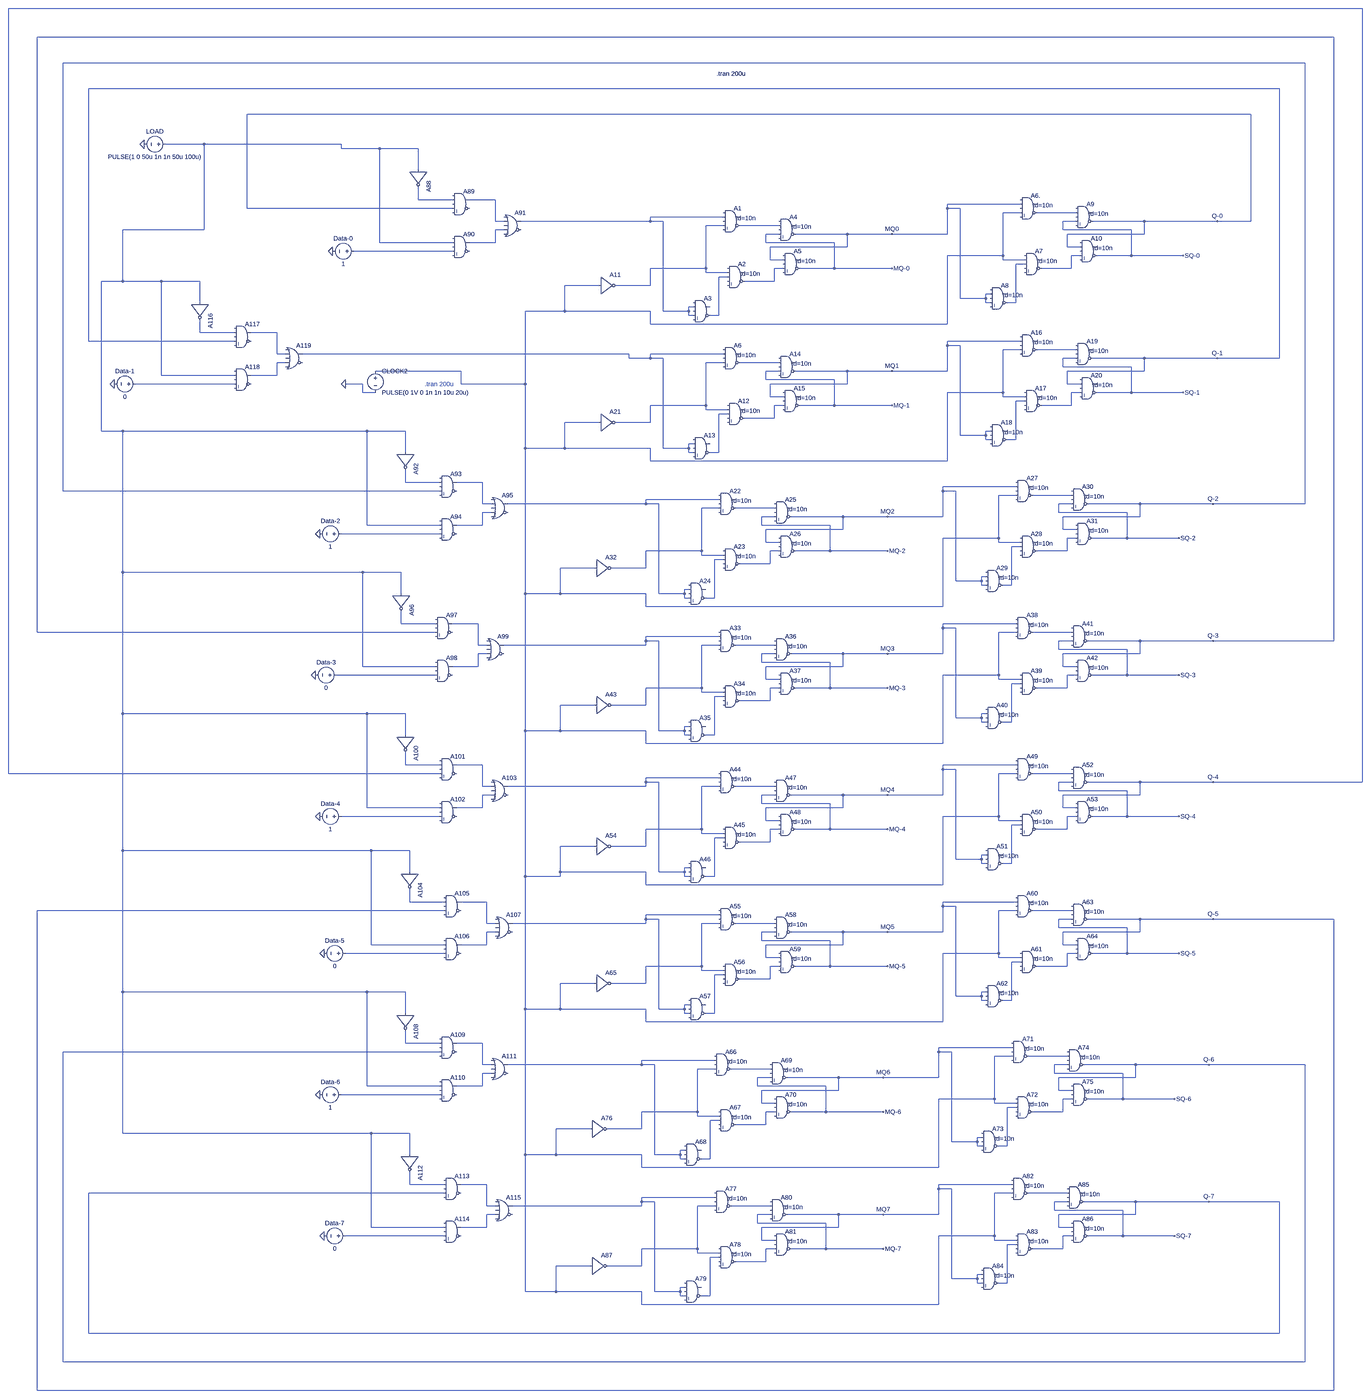
[diagram p0: schematic 8-Bit-Register.asc, whole sheet]
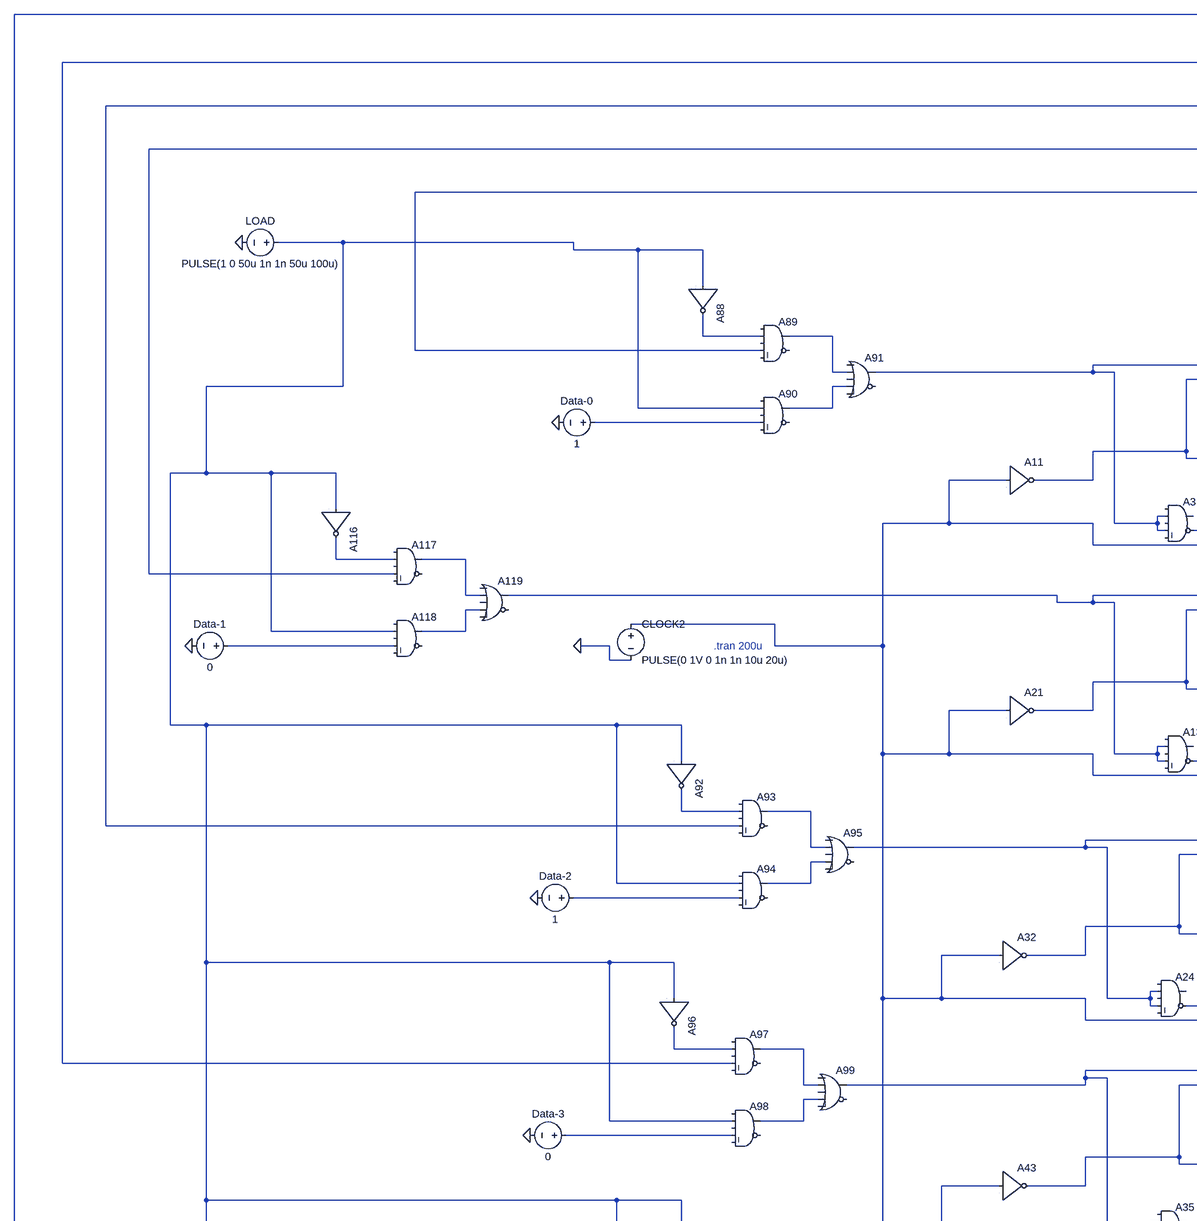
[diagram p1: schematic 8-Bit-Register.asc, part, row 1 of 2, column 1 of 2]
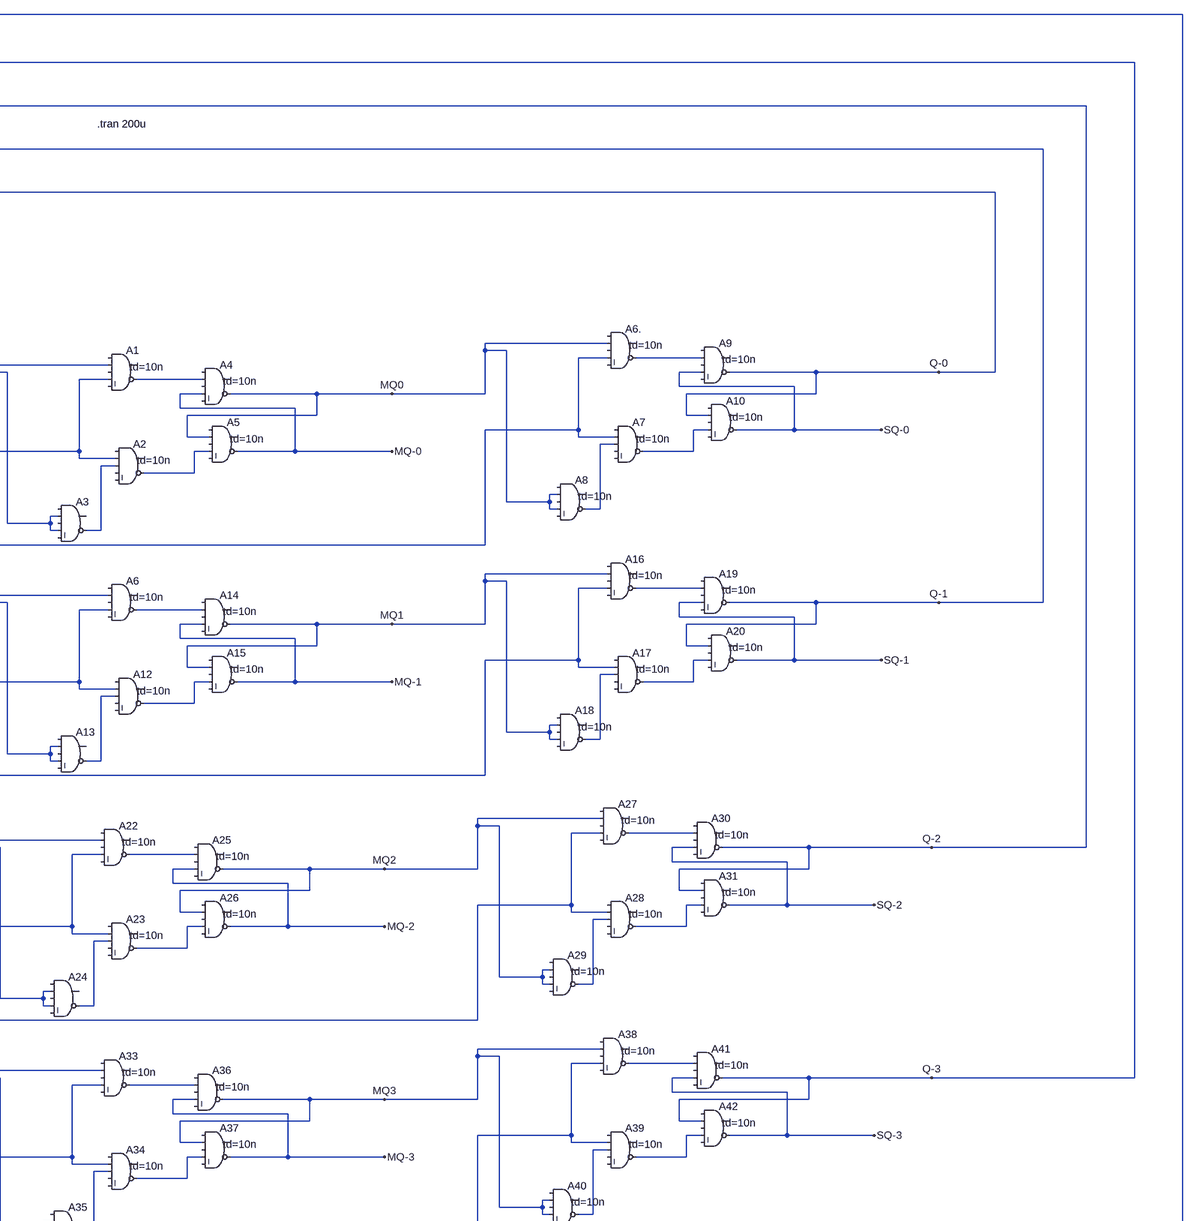
[diagram p2: schematic 8-Bit-Register.asc, part, row 1 of 2, column 2 of 2]
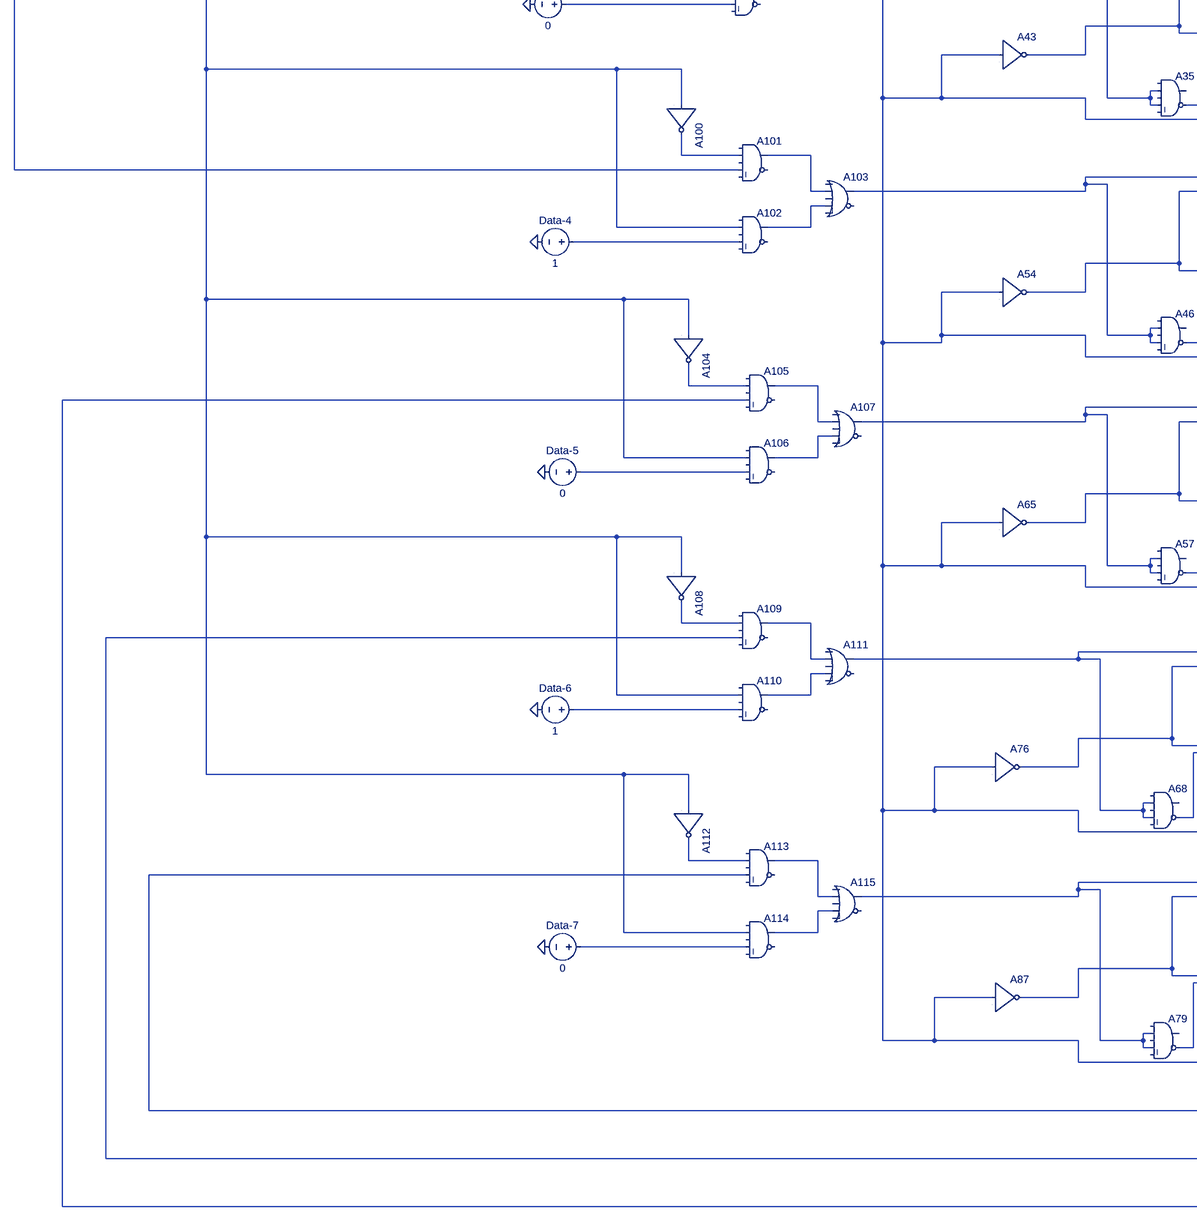
[diagram p3: schematic 8-Bit-Register.asc, part, row 2 of 2, column 1 of 2]
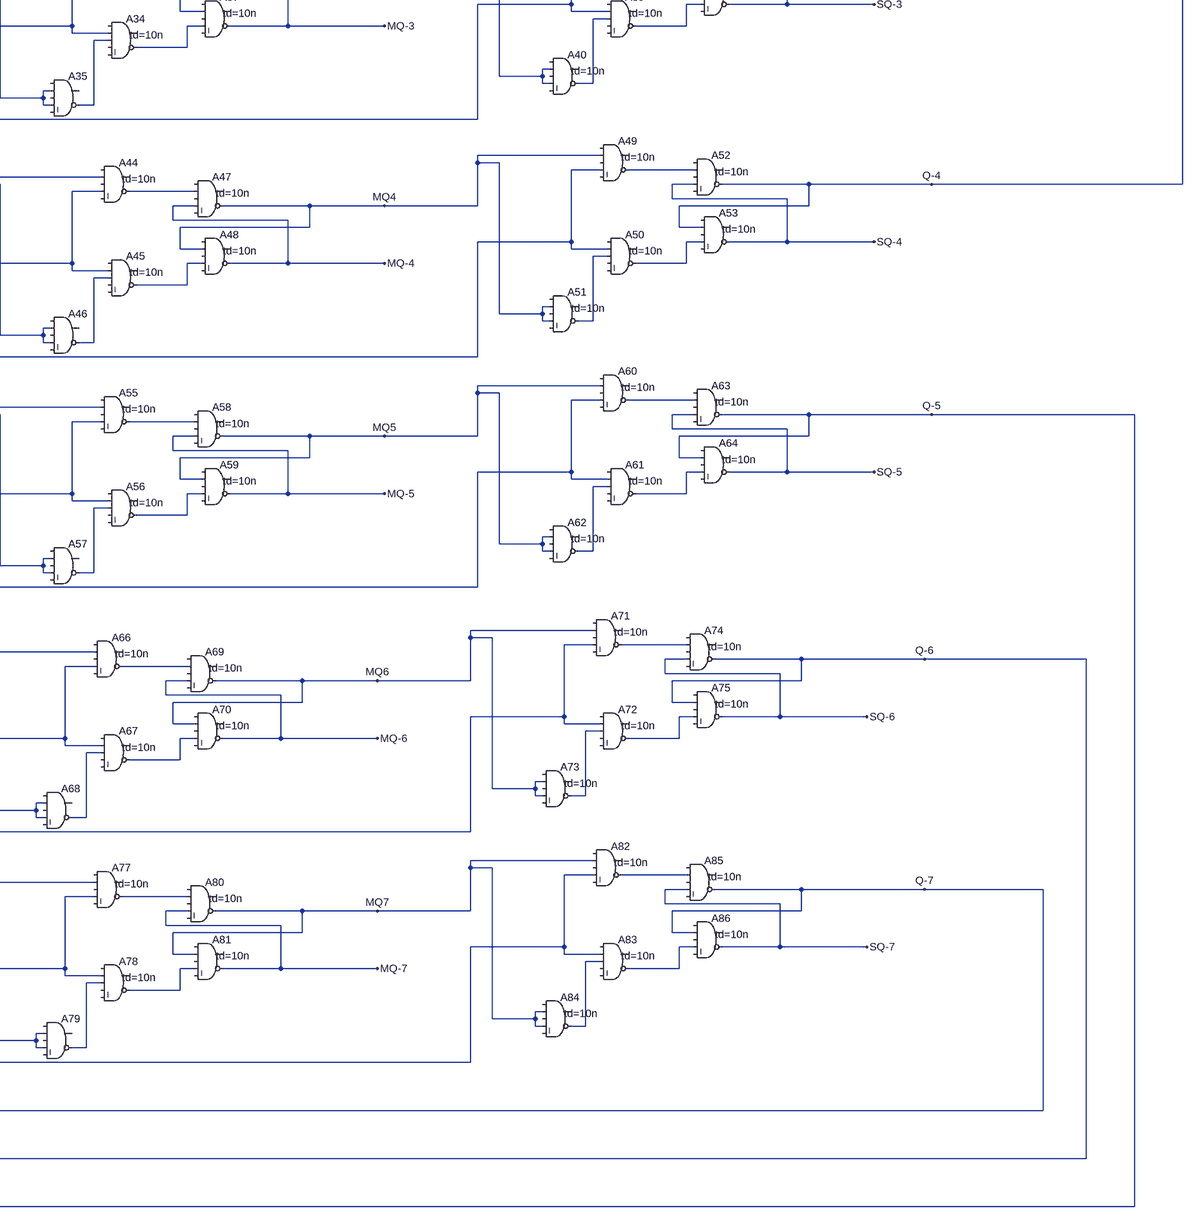
[diagram p4: schematic 8-Bit-Register.asc, part, row 2 of 2, column 2 of 2]
8-Bit-Register.asc, the LTspice schematic file:
Version 4.1
SHEET 1 3268 4692
WIRE 3152 -768 -2224 -768
WIRE 3040 -656 -2112 -656
WIRE 2928 -560 -2016 -560
WIRE 2832 -464 -1920 -464
WIRE 2720 -368 -1328 -368
WIRE -1488 -256 -1632 -256
WIRE -976 -256 -1488 -256
WIRE -976 -240 -976 -256
WIRE -832 -240 -976 -240
WIRE -688 -240 -832 -240
WIRE -688 -160 -688 -240
WIRE -688 -48 -688 -96
WIRE -560 -48 -688 -48
WIRE -400 -48 -496 -48
WIRE 1696 -32 1424 -32
WIRE -1328 -16 -1328 -368
WIRE -560 -16 -1328 -16
WIRE 1424 -16 1424 -32
WIRE 1472 -16 1424 -16
WIRE 1696 0 1632 0
WIRE 1904 0 1760 0
WIRE 496 16 224 16
WIRE -400 32 -400 -48
WIRE -368 32 -400 32
WIRE 224 32 224 16
WIRE 224 32 -304 32
WIRE 272 32 224 32
WIRE 1904 32 1856 32
WIRE 2160 32 1968 32
WIRE 2480 32 2160 32
WIRE 2720 32 2720 -368
WIRE 2720 32 2480 32
WIRE 496 48 432 48
WIRE 704 48 560 48
WIRE -1488 64 -1488 -256
WIRE -1488 64 -1792 64
WIRE -368 64 -400 64
WIRE 1856 64 1856 32
WIRE 2112 64 1856 64
WIRE 704 80 656 80
WIRE 960 80 768 80
WIRE 1152 80 960 80
WIRE 1424 80 1424 -16
WIRE 1424 80 1152 80
WIRE 2160 80 2160 32
WIRE 2160 80 1872 80
WIRE -832 112 -832 -240
WIRE -560 112 -832 112
WIRE -400 112 -400 64
WIRE -400 112 -496 112
WIRE 656 112 656 80
WIRE 912 112 656 112
WIRE 960 128 960 80
WIRE 960 128 672 128
WIRE 1872 128 1872 80
WIRE 1920 128 1872 128
WIRE -560 144 -928 144
WIRE 1632 160 1632 0
WIRE 1632 160 1424 160
WIRE 1920 160 1888 160
WIRE 2112 160 2112 64
WIRE 2112 160 1984 160
WIRE 2352 160 2112 160
WIRE 672 176 672 128
WIRE 720 176 672 176
WIRE 1632 176 1632 160
WIRE 1712 176 1632 176
WIRE 1712 192 1680 192
WIRE 432 208 432 48
WIRE 432 208 224 208
WIRE 720 208 688 208
WIRE 912 208 912 112
WIRE 912 208 784 208
WIRE 1152 208 912 208
WIRE 1888 208 1888 160
WIRE 1888 208 1776 208
WIRE 432 224 432 208
WIRE 512 224 432 224
WIRE 512 240 480 240
WIRE -1792 256 -1792 64
WIRE -1792 256 -1872 256
WIRE -1648 256 -1792 256
WIRE -1504 256 -1648 256
WIRE 688 256 688 208
WIRE 688 256 576 256
WIRE 32 272 -96 272
WIRE 224 272 224 208
WIRE 224 272 96 272
WIRE 1584 304 1568 304
WIRE 1472 320 1472 -16
WIRE 1568 320 1568 304
WIRE 1568 320 1472 320
WIRE -1504 336 -1504 256
WIRE 1568 336 1568 320
WIRE 1584 336 1568 336
WIRE 1680 336 1680 192
WIRE 1680 336 1648 336
WIRE 384 352 368 352
WIRE -96 368 -96 272
WIRE -96 368 -288 368
WIRE 224 368 -96 368
WIRE 272 368 272 32
WIRE 368 368 368 352
WIRE 368 368 272 368
WIRE 368 384 368 368
WIRE 384 384 368 384
WIRE 480 384 480 240
WIRE 480 384 448 384
WIRE 224 416 224 368
WIRE 1424 416 1424 160
WIRE 1424 416 224 416
WIRE -1504 448 -1504 400
WIRE -1376 448 -1504 448
WIRE -1216 448 -1312 448
WIRE -1920 480 -1920 -464
WIRE -1376 480 -1920 480
WIRE 1696 480 1424 480
WIRE 1424 496 1424 480
WIRE 1472 496 1424 496
WIRE 1696 512 1632 512
WIRE 1904 512 1760 512
WIRE -1216 528 -1216 448
WIRE -1184 528 -1216 528
WIRE 144 528 -1120 528
WIRE 496 528 224 528
WIRE 144 544 144 528
WIRE 224 544 224 528
WIRE 224 544 144 544
WIRE 272 544 224 544
WIRE 1904 544 1856 544
WIRE 2160 544 1968 544
WIRE 2480 544 2160 544
WIRE 2832 544 2832 -464
WIRE 2832 544 2480 544
WIRE -1184 560 -1216 560
WIRE 496 560 432 560
WIRE 704 560 560 560
WIRE 1856 576 1856 544
WIRE 2112 576 1856 576
WIRE -528 592 -848 592
WIRE 704 592 656 592
WIRE 960 592 768 592
WIRE 1152 592 960 592
WIRE 1424 592 1424 496
WIRE 1424 592 1152 592
WIRE 2160 592 2160 544
WIRE 2160 592 1872 592
WIRE -1648 608 -1648 256
WIRE -1376 608 -1648 608
WIRE -1216 608 -1216 560
WIRE -1216 608 -1312 608
WIRE 656 624 656 592
WIRE 912 624 656 624
WIRE -1376 640 -1744 640
WIRE -896 640 -960 640
WIRE -528 640 -528 592
WIRE -288 640 -288 368
WIRE -288 640 -528 640
WIRE 960 640 960 592
WIRE 960 640 672 640
WIRE 1872 640 1872 592
WIRE 1920 640 1872 640
WIRE -896 672 -896 640
WIRE -848 672 -896 672
WIRE 1632 672 1632 512
WIRE 1632 672 1424 672
WIRE 1920 672 1888 672
WIRE 2112 672 2112 576
WIRE 2112 672 1984 672
WIRE 2352 672 2112 672
WIRE 672 688 672 640
WIRE 720 688 672 688
WIRE 1632 688 1632 672
WIRE 1712 688 1632 688
WIRE 1712 704 1680 704
WIRE 432 720 432 560
WIRE 432 720 224 720
WIRE 720 720 688 720
WIRE 912 720 912 624
WIRE 912 720 784 720
WIRE 1152 720 912 720
WIRE 1888 720 1888 672
WIRE 1888 720 1776 720
WIRE 432 736 432 720
WIRE 512 736 432 736
WIRE 512 752 480 752
WIRE 688 768 688 720
WIRE 688 768 576 768
WIRE 32 784 -96 784
WIRE 224 784 224 720
WIRE 224 784 96 784
WIRE -1872 816 -1872 256
WIRE -1792 816 -1872 816
WIRE -880 816 -1792 816
WIRE -736 816 -880 816
WIRE 1584 816 1568 816
WIRE 1472 832 1472 496
WIRE 1568 832 1568 816
WIRE 1568 832 1472 832
WIRE 1568 848 1568 832
WIRE 1584 848 1568 848
WIRE 1680 848 1680 704
WIRE 1680 848 1648 848
WIRE 384 864 368 864
WIRE -288 880 -288 640
WIRE -96 880 -96 784
WIRE -96 880 -288 880
WIRE 224 880 -96 880
WIRE 272 880 272 544
WIRE 368 880 368 864
WIRE 368 880 272 880
WIRE -736 896 -736 816
WIRE 368 896 368 880
WIRE 384 896 368 896
WIRE 480 896 480 752
WIRE 480 896 448 896
WIRE 224 928 224 880
WIRE 1424 928 1424 672
WIRE 1424 928 224 928
WIRE -736 1008 -736 960
WIRE -608 1008 -736 1008
WIRE -448 1008 -544 1008
WIRE 1680 1024 1408 1024
WIRE -2016 1040 -2016 -560
WIRE -608 1040 -2016 1040
WIRE 1408 1040 1408 1024
WIRE 1456 1040 1408 1040
WIRE 1680 1056 1616 1056
WIRE 1888 1056 1744 1056
WIRE 480 1072 208 1072
WIRE -448 1088 -448 1008
WIRE -416 1088 -448 1088
WIRE 208 1088 208 1072
WIRE 208 1088 -352 1088
WIRE 256 1088 208 1088
WIRE 1888 1088 1840 1088
WIRE 2144 1088 1952 1088
WIRE 2464 1088 2144 1088
WIRE 2928 1088 2928 -560
WIRE 2928 1088 2464 1088
WIRE 480 1104 416 1104
WIRE 688 1104 544 1104
WIRE -416 1120 -448 1120
WIRE 1840 1120 1840 1088
WIRE 2096 1120 1840 1120
WIRE 688 1136 640 1136
WIRE 944 1136 752 1136
WIRE 1136 1136 944 1136
WIRE 1408 1136 1408 1040
WIRE 1408 1136 1136 1136
WIRE 2144 1136 2144 1088
WIRE 2144 1136 1856 1136
WIRE -880 1168 -880 816
WIRE -608 1168 -880 1168
WIRE -448 1168 -448 1120
WIRE -448 1168 -544 1168
WIRE 640 1168 640 1136
WIRE 896 1168 640 1168
WIRE 944 1184 944 1136
WIRE 944 1184 656 1184
WIRE 1856 1184 1856 1136
WIRE 1904 1184 1856 1184
WIRE -608 1200 -976 1200
WIRE 1616 1216 1616 1056
WIRE 1616 1216 1408 1216
WIRE 1904 1216 1872 1216
WIRE 2096 1216 2096 1120
WIRE 2096 1216 1968 1216
WIRE 2336 1216 2096 1216
WIRE 656 1232 656 1184
WIRE 704 1232 656 1232
WIRE 1616 1232 1616 1216
WIRE 1696 1232 1616 1232
WIRE 1696 1248 1664 1248
WIRE 416 1264 416 1104
WIRE 416 1264 208 1264
WIRE 704 1264 672 1264
WIRE 896 1264 896 1168
WIRE 896 1264 768 1264
WIRE 1136 1264 896 1264
WIRE 1872 1264 1872 1216
WIRE 1872 1264 1760 1264
WIRE 416 1280 416 1264
WIRE 496 1280 416 1280
WIRE 496 1296 464 1296
WIRE 672 1312 672 1264
WIRE 672 1312 560 1312
WIRE 16 1328 -112 1328
WIRE 208 1328 208 1264
WIRE 208 1328 80 1328
WIRE -1792 1344 -1792 816
WIRE -896 1344 -1792 1344
WIRE -752 1344 -896 1344
WIRE 1568 1360 1552 1360
WIRE 1456 1376 1456 1040
WIRE 1552 1376 1552 1360
WIRE 1552 1376 1456 1376
WIRE 1552 1392 1552 1376
WIRE 1568 1392 1552 1392
WIRE 1664 1392 1664 1248
WIRE 1664 1392 1632 1392
WIRE 368 1408 352 1408
WIRE -752 1424 -752 1344
WIRE -288 1424 -288 880
WIRE -112 1424 -112 1328
WIRE -112 1424 -288 1424
WIRE 208 1424 -112 1424
WIRE 256 1424 256 1088
WIRE 352 1424 352 1408
WIRE 352 1424 256 1424
WIRE 352 1440 352 1424
WIRE 368 1440 352 1440
WIRE 464 1440 464 1296
WIRE 464 1440 432 1440
WIRE 208 1472 208 1424
WIRE 1408 1472 1408 1216
WIRE 1408 1472 208 1472
WIRE -752 1536 -752 1488
WIRE -624 1536 -752 1536
WIRE -464 1536 -560 1536
WIRE 1680 1536 1408 1536
WIRE 1408 1552 1408 1536
WIRE 1456 1552 1408 1552
WIRE -2112 1568 -2112 -656
WIRE -624 1568 -2112 1568
WIRE 1680 1568 1616 1568
WIRE 1888 1568 1744 1568
WIRE 480 1584 208 1584
WIRE 208 1600 208 1584
WIRE 256 1600 208 1600
WIRE 1888 1600 1840 1600
WIRE 2144 1600 1952 1600
WIRE 2464 1600 2144 1600
WIRE 3040 1600 3040 -656
WIRE 3040 1600 2464 1600
WIRE -464 1616 -464 1536
WIRE -432 1616 -464 1616
WIRE 208 1616 208 1600
WIRE 208 1616 -368 1616
WIRE 480 1616 416 1616
WIRE 688 1616 544 1616
WIRE 1840 1632 1840 1600
WIRE 2096 1632 1840 1632
WIRE -432 1648 -464 1648
WIRE 688 1648 640 1648
WIRE 944 1648 752 1648
WIRE 1136 1648 944 1648
WIRE 1408 1648 1408 1552
WIRE 1408 1648 1136 1648
WIRE 2144 1648 2144 1600
WIRE 2144 1648 1856 1648
WIRE 640 1680 640 1648
WIRE 896 1680 640 1680
WIRE -896 1696 -896 1344
WIRE -624 1696 -896 1696
WIRE -464 1696 -464 1648
WIRE -464 1696 -560 1696
WIRE 944 1696 944 1648
WIRE 944 1696 656 1696
WIRE 1856 1696 1856 1648
WIRE 1904 1696 1856 1696
WIRE -624 1728 -992 1728
WIRE 1616 1728 1616 1568
WIRE 1616 1728 1408 1728
WIRE 1904 1728 1872 1728
WIRE 2096 1728 2096 1632
WIRE 2096 1728 1968 1728
WIRE 2336 1728 2096 1728
WIRE 656 1744 656 1696
WIRE 704 1744 656 1744
WIRE 1616 1744 1616 1728
WIRE 1696 1744 1616 1744
WIRE 1696 1760 1664 1760
WIRE 416 1776 416 1616
WIRE 416 1776 208 1776
WIRE 704 1776 672 1776
WIRE 896 1776 896 1680
WIRE 896 1776 768 1776
WIRE 1136 1776 896 1776
WIRE 1872 1776 1872 1728
WIRE 1872 1776 1760 1776
WIRE 416 1792 416 1776
WIRE 496 1792 416 1792
WIRE 496 1808 464 1808
WIRE 672 1824 672 1776
WIRE 672 1824 560 1824
WIRE 16 1840 -112 1840
WIRE 208 1840 208 1776
WIRE 208 1840 80 1840
WIRE -1792 1872 -1792 1344
WIRE -880 1872 -1792 1872
WIRE -736 1872 -880 1872
WIRE 1568 1872 1552 1872
WIRE 1456 1888 1456 1552
WIRE 1552 1888 1552 1872
WIRE 1552 1888 1456 1888
WIRE 1552 1904 1552 1888
WIRE 1568 1904 1552 1904
WIRE 1664 1904 1664 1760
WIRE 1664 1904 1632 1904
WIRE 368 1920 352 1920
WIRE -288 1936 -288 1424
WIRE -112 1936 -112 1840
WIRE -112 1936 -288 1936
WIRE 208 1936 -112 1936
WIRE 256 1936 256 1600
WIRE 352 1936 352 1920
WIRE 352 1936 256 1936
WIRE -736 1952 -736 1872
WIRE 352 1952 352 1936
WIRE 368 1952 352 1952
WIRE 464 1952 464 1808
WIRE 464 1952 432 1952
WIRE 208 1984 208 1936
WIRE 1408 1984 1408 1728
WIRE 1408 1984 208 1984
WIRE -736 2064 -736 2016
WIRE -608 2064 -736 2064
WIRE -448 2064 -544 2064
WIRE 1680 2064 1408 2064
WIRE 1408 2080 1408 2064
WIRE 1456 2080 1408 2080
WIRE -2224 2096 -2224 -768
WIRE -608 2096 -2224 2096
WIRE 1680 2096 1616 2096
WIRE 1888 2096 1744 2096
WIRE 480 2112 208 2112
WIRE 208 2128 208 2112
WIRE 256 2128 208 2128
WIRE 1888 2128 1840 2128
WIRE 2144 2128 1952 2128
WIRE 2464 2128 2144 2128
WIRE 3152 2128 3152 -768
WIRE 3152 2128 2464 2128
WIRE -448 2144 -448 2064
WIRE -416 2144 -448 2144
WIRE 208 2144 208 2128
WIRE 208 2144 -352 2144
WIRE 480 2144 416 2144
WIRE 688 2144 544 2144
WIRE 1840 2160 1840 2128
WIRE 2096 2160 1840 2160
WIRE -416 2176 -448 2176
WIRE 688 2176 640 2176
WIRE 944 2176 752 2176
WIRE 1136 2176 944 2176
WIRE 1408 2176 1408 2080
WIRE 1408 2176 1136 2176
WIRE 2144 2176 2144 2128
WIRE 2144 2176 1856 2176
WIRE 640 2208 640 2176
WIRE 896 2208 640 2208
WIRE -880 2224 -880 1872
WIRE -608 2224 -880 2224
WIRE -448 2224 -448 2176
WIRE -448 2224 -544 2224
WIRE 944 2224 944 2176
WIRE 944 2224 656 2224
WIRE 1856 2224 1856 2176
WIRE 1904 2224 1856 2224
WIRE -608 2256 -976 2256
WIRE 1616 2256 1616 2096
WIRE 1616 2256 1408 2256
WIRE 1904 2256 1872 2256
WIRE 2096 2256 2096 2160
WIRE 2096 2256 1968 2256
WIRE 2336 2256 2096 2256
WIRE 656 2272 656 2224
WIRE 704 2272 656 2272
WIRE 1616 2272 1616 2256
WIRE 1696 2272 1616 2272
WIRE 1696 2288 1664 2288
WIRE 416 2304 416 2144
WIRE 416 2304 208 2304
WIRE 704 2304 672 2304
WIRE 896 2304 896 2208
WIRE 896 2304 768 2304
WIRE 1136 2304 896 2304
WIRE 1872 2304 1872 2256
WIRE 1872 2304 1760 2304
WIRE 416 2320 416 2304
WIRE 496 2320 416 2320
WIRE 496 2336 464 2336
WIRE 672 2352 672 2304
WIRE 672 2352 560 2352
WIRE 16 2368 -112 2368
WIRE 208 2368 208 2304
WIRE 208 2368 80 2368
WIRE -1792 2384 -1792 1872
WIRE -864 2384 -1792 2384
WIRE -720 2384 -864 2384
WIRE 1568 2400 1552 2400
WIRE 1456 2416 1456 2080
WIRE 1552 2416 1552 2400
WIRE 1552 2416 1456 2416
WIRE 1552 2432 1552 2416
WIRE 1568 2432 1552 2432
WIRE 1664 2432 1664 2288
WIRE 1664 2432 1632 2432
WIRE 368 2448 352 2448
WIRE -720 2464 -720 2384
WIRE -112 2464 -112 2368
WIRE 208 2464 -112 2464
WIRE 256 2464 256 2128
WIRE 352 2464 352 2448
WIRE 352 2464 256 2464
WIRE -288 2480 -288 1936
WIRE -112 2480 -112 2464
WIRE -112 2480 -288 2480
WIRE 352 2480 352 2464
WIRE 368 2480 352 2480
WIRE 464 2480 464 2336
WIRE 464 2480 432 2480
WIRE 208 2512 208 2464
WIRE 1408 2512 1408 2256
WIRE 1408 2512 208 2512
WIRE -720 2576 -720 2528
WIRE -592 2576 -720 2576
WIRE -432 2576 -528 2576
WIRE 1680 2576 1408 2576
WIRE 1408 2592 1408 2576
WIRE 1456 2592 1408 2592
WIRE -592 2608 -2112 2608
WIRE 1680 2608 1616 2608
WIRE 1888 2608 1744 2608
WIRE 480 2624 208 2624
WIRE 208 2640 208 2624
WIRE 256 2640 208 2640
WIRE 1888 2640 1840 2640
WIRE 2144 2640 1952 2640
WIRE 2464 2640 2144 2640
WIRE 3040 2640 2464 2640
WIRE -432 2656 -432 2576
WIRE -400 2656 -432 2656
WIRE 208 2656 208 2640
WIRE 208 2656 -336 2656
WIRE 480 2656 416 2656
WIRE 688 2656 544 2656
WIRE 1840 2672 1840 2640
WIRE 2096 2672 1840 2672
WIRE -400 2688 -432 2688
WIRE 688 2688 640 2688
WIRE 944 2688 752 2688
WIRE 1136 2688 944 2688
WIRE 1408 2688 1408 2592
WIRE 1408 2688 1136 2688
WIRE 2144 2688 2144 2640
WIRE 2144 2688 1856 2688
WIRE 640 2720 640 2688
WIRE 896 2720 640 2720
WIRE -864 2736 -864 2384
WIRE -592 2736 -864 2736
WIRE -432 2736 -432 2688
WIRE -432 2736 -528 2736
WIRE 944 2736 944 2688
WIRE 944 2736 656 2736
WIRE 1856 2736 1856 2688
WIRE 1904 2736 1856 2736
WIRE -592 2768 -960 2768
WIRE 1616 2768 1616 2608
WIRE 1616 2768 1408 2768
WIRE 1904 2768 1872 2768
WIRE 2096 2768 2096 2672
WIRE 2096 2768 1968 2768
WIRE 2336 2768 2096 2768
WIRE 656 2784 656 2736
WIRE 704 2784 656 2784
WIRE 1616 2784 1616 2768
WIRE 1696 2784 1616 2784
WIRE 1696 2800 1664 2800
WIRE 416 2816 416 2656
WIRE 416 2816 208 2816
WIRE 704 2816 672 2816
WIRE 896 2816 896 2720
WIRE 896 2816 768 2816
WIRE 1136 2816 896 2816
WIRE 1872 2816 1872 2768
WIRE 1872 2816 1760 2816
WIRE 416 2832 416 2816
WIRE 496 2832 416 2832
WIRE 496 2848 464 2848
WIRE 672 2864 672 2816
WIRE 672 2864 560 2864
WIRE 16 2880 -112 2880
WIRE 208 2880 208 2816
WIRE 208 2880 80 2880
WIRE -1792 2912 -1792 2384
WIRE -880 2912 -1792 2912
WIRE -736 2912 -880 2912
WIRE 1568 2912 1552 2912
WIRE 1456 2928 1456 2592
WIRE 1552 2928 1552 2912
WIRE 1552 2928 1456 2928
WIRE 1552 2944 1552 2928
WIRE 1568 2944 1552 2944
WIRE 1664 2944 1664 2800
WIRE 1664 2944 1632 2944
WIRE 368 2960 352 2960
WIRE -288 2976 -288 2480
WIRE -112 2976 -112 2880
WIRE -112 2976 -288 2976
WIRE 208 2976 -112 2976
WIRE 256 2976 256 2640
WIRE 352 2976 352 2960
WIRE 352 2976 256 2976
WIRE -736 2992 -736 2912
WIRE 352 2992 352 2976
WIRE 368 2992 352 2992
WIRE 464 2992 464 2848
WIRE 464 2992 432 2992
WIRE 208 3024 208 2976
WIRE 1408 3024 1408 2768
WIRE 1408 3024 208 3024
WIRE -736 3104 -736 3056
WIRE -608 3104 -736 3104
WIRE -448 3104 -544 3104
WIRE 1664 3120 1392 3120
WIRE -608 3136 -2016 3136
WIRE 1392 3136 1392 3120
WIRE 1440 3136 1392 3136
WIRE 1664 3152 1600 3152
WIRE 1872 3152 1728 3152
WIRE 464 3168 192 3168
WIRE -448 3184 -448 3104
WIRE -416 3184 -448 3184
WIRE 192 3184 192 3168
WIRE 192 3184 -352 3184
WIRE 240 3184 192 3184
WIRE 1872 3184 1824 3184
WIRE 2128 3184 1936 3184
WIRE 2448 3184 2128 3184
WIRE 2928 3184 2448 3184
WIRE 464 3200 400 3200
WIRE 672 3200 528 3200
WIRE -416 3216 -448 3216
WIRE 1824 3216 1824 3184
WIRE 2080 3216 1824 3216
WIRE 672 3232 624 3232
WIRE 928 3232 736 3232
WIRE 1120 3232 928 3232
WIRE 1392 3232 1392 3136
WIRE 1392 3232 1120 3232
WIRE 2128 3232 2128 3184
WIRE 2128 3232 1840 3232
WIRE -880 3264 -880 2912
WIRE -608 3264 -880 3264
WIRE -448 3264 -448 3216
WIRE -448 3264 -544 3264
WIRE 624 3264 624 3232
WIRE 880 3264 624 3264
WIRE 928 3280 928 3232
WIRE 928 3280 640 3280
WIRE 1840 3280 1840 3232
WIRE 1888 3280 1840 3280
WIRE -608 3296 -976 3296
WIRE 1600 3312 1600 3152
WIRE 1600 3312 1392 3312
WIRE 1888 3312 1856 3312
WIRE 2080 3312 2080 3216
WIRE 2080 3312 1952 3312
WIRE 2320 3312 2080 3312
WIRE 640 3328 640 3280
WIRE 688 3328 640 3328
WIRE 1600 3328 1600 3312
WIRE 1680 3328 1600 3328
WIRE 1680 3344 1648 3344
WIRE 400 3360 400 3200
WIRE 400 3360 192 3360
WIRE 688 3360 656 3360
WIRE 880 3360 880 3264
WIRE 880 3360 752 3360
WIRE 1120 3360 880 3360
WIRE 1856 3360 1856 3312
WIRE 1856 3360 1744 3360
WIRE 400 3376 400 3360
WIRE 480 3376 400 3376
WIRE 480 3392 448 3392
WIRE 656 3408 656 3360
WIRE 656 3408 544 3408
WIRE 0 3424 -128 3424
WIRE 192 3424 192 3360
WIRE 192 3424 64 3424
WIRE -1792 3440 -1792 2912
WIRE -864 3440 -1792 3440
WIRE -720 3440 -864 3440
WIRE 1552 3456 1536 3456
WIRE 1440 3472 1440 3136
WIRE 1536 3472 1536 3456
WIRE 1536 3472 1440 3472
WIRE 1536 3488 1536 3472
WIRE 1552 3488 1536 3488
WIRE 1648 3488 1648 3344
WIRE 1648 3488 1616 3488
WIRE 352 3504 336 3504
WIRE -720 3520 -720 3440
WIRE -288 3520 -288 2976
WIRE -128 3520 -128 3424
WIRE -128 3520 -288 3520
WIRE 192 3520 -128 3520
WIRE 240 3520 240 3184
WIRE 336 3520 336 3504
WIRE 336 3520 240 3520
WIRE 336 3536 336 3520
WIRE 352 3536 336 3536
WIRE 448 3536 448 3392
WIRE 448 3536 416 3536
WIRE 192 3568 192 3520
WIRE 1392 3568 1392 3312
WIRE 1392 3568 192 3568
WIRE -720 3632 -720 3584
WIRE -592 3632 -720 3632
WIRE -432 3632 -528 3632
WIRE 1664 3632 1392 3632
WIRE 1392 3648 1392 3632
WIRE 1440 3648 1392 3648
WIRE -592 3664 -1920 3664
WIRE 1664 3664 1600 3664
WIRE 1872 3664 1728 3664
WIRE 464 3680 192 3680
WIRE 192 3696 192 3680
WIRE 240 3696 192 3696
WIRE 1872 3696 1824 3696
WIRE 2128 3696 1936 3696
WIRE 2448 3696 2128 3696
WIRE 2832 3696 2448 3696
WIRE -432 3712 -432 3632
WIRE -400 3712 -432 3712
WIRE 192 3712 192 3696
WIRE 192 3712 -336 3712
WIRE 464 3712 400 3712
WIRE 672 3712 528 3712
WIRE 1824 3728 1824 3696
WIRE 2080 3728 1824 3728
WIRE -400 3744 -432 3744
WIRE 672 3744 624 3744
WIRE 928 3744 736 3744
WIRE 1120 3744 928 3744
WIRE 1392 3744 1392 3648
WIRE 1392 3744 1120 3744
WIRE 2128 3744 2128 3696
WIRE 2128 3744 1840 3744
WIRE 624 3776 624 3744
WIRE 880 3776 624 3776
WIRE -864 3792 -864 3440
WIRE -592 3792 -864 3792
WIRE -432 3792 -432 3744
WIRE -432 3792 -528 3792
WIRE 928 3792 928 3744
WIRE 928 3792 640 3792
WIRE 1840 3792 1840 3744
WIRE 1888 3792 1840 3792
WIRE -592 3824 -960 3824
WIRE 1600 3824 1600 3664
WIRE 1600 3824 1392 3824
WIRE 1888 3824 1856 3824
WIRE 2080 3824 2080 3728
WIRE 2080 3824 1952 3824
WIRE 2320 3824 2080 3824
WIRE 640 3840 640 3792
WIRE 688 3840 640 3840
WIRE 1600 3840 1600 3824
WIRE 1680 3840 1600 3840
WIRE 1680 3856 1648 3856
WIRE 400 3872 400 3712
WIRE 400 3872 192 3872
WIRE 688 3872 656 3872
WIRE 880 3872 880 3776
WIRE 880 3872 752 3872
WIRE 1120 3872 880 3872
WIRE 1856 3872 1856 3824
WIRE 1856 3872 1744 3872
WIRE 400 3888 400 3872
WIRE 480 3888 400 3888
WIRE 480 3904 448 3904
WIRE 656 3920 656 3872
WIRE 656 3920 544 3920
WIRE 0 3936 -128 3936
WIRE 192 3936 192 3872
WIRE 192 3936 64 3936
WIRE 1552 3968 1536 3968
WIRE 1440 3984 1440 3648
WIRE 1536 3984 1536 3968
WIRE 1536 3984 1440 3984
WIRE 1536 4000 1536 3984
WIRE 1552 4000 1536 4000
WIRE 1648 4000 1648 3856
WIRE 1648 4000 1616 4000
WIRE 352 4016 336 4016
WIRE -288 4032 -288 3520
WIRE -128 4032 -128 3936
WIRE -128 4032 -288 4032
WIRE 192 4032 -128 4032
WIRE 240 4032 240 3696
WIRE 336 4032 336 4016
WIRE 336 4032 240 4032
WIRE 336 4048 336 4032
WIRE 352 4048 336 4048
WIRE 448 4048 448 3904
WIRE 448 4048 416 4048
WIRE 192 4080 192 4032
WIRE 1392 4080 1392 3824
WIRE 1392 4080 192 4080
WIRE -1920 4448 -1920 3664
WIRE 2832 4448 2832 3696
WIRE 2832 4448 -1920 4448
WIRE -2016 4576 -2016 3136
WIRE 2928 4576 2928 3184
WIRE 2928 4576 -2016 4576
WIRE -2112 4688 -2112 2608
WIRE 3040 4688 3040 2640
WIRE 3040 4688 -2112 4688
FLAG 1152 80 MQ0
FLAG 1152 208 MQ-0
FLAG 2352 160 SQ-0
FLAG 2480 32 Q-0
FLAG -960 640 0
FLAG 1152 592 MQ1
FLAG 1152 720 MQ-1
FLAG 2352 672 SQ-1
FLAG 2480 544 Q-1
FLAG 1136 1136 MQ2
FLAG 1136 1264 MQ-2
FLAG 2336 1216 SQ-2
FLAG 2464 1088 Q-2
FLAG 1136 1648 MQ3
FLAG 1136 1776 MQ-3
FLAG 2336 1728 SQ-3
FLAG 2464 1600 Q-3
FLAG 1136 2176 MQ4
FLAG 1136 2304 MQ-4
FLAG 2336 2256 SQ-4
FLAG 2464 2128 Q-4
FLAG 1136 2688 MQ5
FLAG 1136 2816 MQ-5
FLAG 2336 2768 SQ-5
FLAG 2464 2640 Q-5
FLAG 1120 3232 MQ6
FLAG 1120 3360 MQ-6
FLAG 2320 3312 SQ-6
FLAG 2448 3184 Q-6
FLAG 1120 3744 MQ7
FLAG 1120 3872 MQ-7
FLAG 2320 3824 SQ-7
FLAG 2448 3696 Q-7
FLAG -1824 640 0
FLAG -1008 144 0
FLAG -1056 1200 0
FLAG -1072 1728 0
FLAG -1056 2256 0
FLAG -1040 2768 0
FLAG -1056 3296 0
FLAG -1040 3824 0
FLAG -1712 -256 0
SYMBOL Digital\\and 528 -32 R0
WINDOW 3 16 52 Left 2
SYMATTR Value td=10n
SYMATTR InstName A1
SYMBOL Digital\\and 544 176 R0
WINDOW 3 16 52 Left 2
SYMATTR Value td=10n
SYMATTR InstName A2
SYMBOL Digital\\and 416 304 R0
SYMATTR InstName A3
SYMBOL Digital\\and 736 0 R0
WINDOW 3 16 52 Left 2
SYMATTR Value td=10n
SYMATTR InstName A4
SYMBOL Digital\\and 752 128 R0
WINDOW 3 16 52 Left 2
SYMATTR Value td=10n
SYMATTR InstName A5
SYMBOL Digital\\and 1728 -80 R0
WINDOW 3 16 52 Left 2
SYMATTR Value td=10n
SYMATTR InstName A6.
SYMBOL Digital\\and 1744 128 R0
WINDOW 3 16 52 Left 2
SYMATTR Value td=10n
SYMATTR InstName A7
SYMBOL Digital\\and 1616 256 R0
WINDOW 3 16 52 Left 2
SYMATTR Value td=10n
SYMATTR InstName A8
SYMBOL Digital\\and 1936 -48 R0
WINDOW 3 16 52 Left 2
SYMATTR Value td=10n
SYMATTR InstName A9
SYMBOL Digital\\and 1952 80 R0
WINDOW 3 16 52 Left 2
SYMATTR Value td=10n
SYMATTR InstName A10
SYMBOL Digital\\inv 32 208 R0
SYMATTR InstName A11
SYMBOL voltage -848 576 R0
WINDOW 123 0 0 Left 0
WINDOW 39 0 0 Left 0
SYMATTR InstName CLOCK2
SYMATTR Value PULSE(0 1V 0 1n 1n 10u 20u)
SYMBOL Digital\\and 528 480 R0
WINDOW 3 16 52 Left 2
SYMATTR Value td=10n
SYMATTR InstName A6
SYMBOL Digital\\and 544 688 R0
WINDOW 3 16 52 Left 2
SYMATTR Value td=10n
SYMATTR InstName A12
SYMBOL Digital\\and 416 816 R0
SYMATTR InstName A13
SYMBOL Digital\\and 736 512 R0
WINDOW 3 16 52 Left 2
SYMATTR Value td=10n
SYMATTR InstName A14
SYMBOL Digital\\and 752 640 R0
WINDOW 3 16 52 Left 2
SYMATTR Value td=10n
SYMATTR InstName A15
SYMBOL Digital\\and 1728 432 R0
WINDOW 3 16 52 Left 2
SYMATTR Value td=10n
SYMATTR InstName A16
SYMBOL Digital\\and 1744 640 R0
WINDOW 3 16 52 Left 2
SYMATTR Value td=10n
SYMATTR InstName A17
SYMBOL Digital\\and 1616 768 R0
WINDOW 3 16 52 Left 2
SYMATTR Value td=10n
SYMATTR InstName A18
SYMBOL Digital\\and 1936 464 R0
WINDOW 3 16 52 Left 2
SYMATTR Value td=10n
SYMATTR InstName A19
SYMBOL Digital\\and 1952 592 R0
WINDOW 3 16 52 Left 2
SYMATTR Value td=10n
SYMATTR InstName A20
SYMBOL Digital\\inv 32 720 R0
SYMATTR InstName A21
SYMBOL Digital\\and 512 1024 R0
WINDOW 3 16 52 Left 2
SYMATTR Value td=10n
SYMATTR InstName A22
SYMBOL Digital\\and 528 1232 R0
WINDOW 3 16 52 Left 2
SYMATTR Value td=10n
SYMATTR InstName A23
SYMBOL Digital\\and 400 1360 R0
SYMATTR InstName A24
SYMBOL Digital\\and 720 1056 R0
WINDOW 3 16 52 Left 2
SYMATTR Value td=10n
SYMATTR InstName A25
SYMBOL Digital\\and 736 1184 R0
WINDOW 3 16 52 Left 2
SYMATTR Value td=10n
SYMATTR InstName A26
SYMBOL Digital\\and 1712 976 R0
WINDOW 3 16 52 Left 2
SYMATTR Value td=10n
SYMATTR InstName A27
SYMBOL Digital\\and 1728 1184 R0
WINDOW 3 16 52 Left 2
SYMATTR Value td=10n
SYMATTR InstName A28
SYMBOL Digital\\and 1600 1312 R0
WINDOW 3 16 52 Left 2
SYMATTR Value td=10n
SYMATTR InstName A29
SYMBOL Digital\\and 1920 1008 R0
WINDOW 3 16 52 Left 2
SYMATTR Value td=10n
SYMATTR InstName A30
SYMBOL Digital\\and 1936 1136 R0
WINDOW 3 16 52 Left 2
SYMATTR Value td=10n
SYMATTR InstName A31
SYMBOL Digital\\inv 16 1264 R0
SYMATTR InstName A32
SYMBOL Digital\\and 512 1536 R0
WINDOW 3 16 52 Left 2
SYMATTR Value td=10n
SYMATTR InstName A33
SYMBOL Digital\\and 528 1744 R0
WINDOW 3 16 52 Left 2
SYMATTR Value td=10n
SYMATTR InstName A34
SYMBOL Digital\\and 400 1872 R0
SYMATTR InstName A35
SYMBOL Digital\\and 720 1568 R0
WINDOW 3 16 52 Left 2
SYMATTR Value td=10n
SYMATTR InstName A36
SYMBOL Digital\\and 736 1696 R0
WINDOW 3 16 52 Left 2
SYMATTR Value td=10n
SYMATTR InstName A37
SYMBOL Digital\\and 1712 1488 R0
WINDOW 3 16 52 Left 2
SYMATTR Value td=10n
SYMATTR InstName A38
SYMBOL Digital\\and 1728 1696 R0
WINDOW 3 16 52 Left 2
SYMATTR Value td=10n
SYMATTR InstName A39
SYMBOL Digital\\and 1600 1824 R0
WINDOW 3 16 52 Left 2
SYMATTR Value td=10n
SYMATTR InstName A40
SYMBOL Digital\\and 1920 1520 R0
WINDOW 3 16 52 Left 2
SYMATTR Value td=10n
SYMATTR InstName A41
SYMBOL Digital\\and 1936 1648 R0
WINDOW 3 16 52 Left 2
SYMATTR Value td=10n
SYMATTR InstName A42
SYMBOL Digital\\inv 16 1776 R0
SYMATTR InstName A43
SYMBOL Digital\\and 512 2064 R0
WINDOW 3 16 52 Left 2
SYMATTR Value td=10n
SYMATTR InstName A44
SYMBOL Digital\\and 528 2272 R0
WINDOW 3 16 52 Left 2
SYMATTR Value td=10n
SYMATTR InstName A45
SYMBOL Digital\\and 400 2400 R0
SYMATTR InstName A46
SYMBOL Digital\\and 720 2096 R0
WINDOW 3 16 52 Left 2
SYMATTR Value td=10n
SYMATTR InstName A47
SYMBOL Digital\\and 736 2224 R0
WINDOW 3 16 52 Left 2
SYMATTR Value td=10n
SYMATTR InstName A48
SYMBOL Digital\\and 1712 2016 R0
WINDOW 3 16 52 Left 2
SYMATTR Value td=10n
SYMATTR InstName A49
SYMBOL Digital\\and 1728 2224 R0
WINDOW 3 16 52 Left 2
SYMATTR Value td=10n
SYMATTR InstName A50
SYMBOL Digital\\and 1600 2352 R0
WINDOW 3 16 52 Left 2
SYMATTR Value td=10n
SYMATTR InstName A51
SYMBOL Digital\\and 1920 2048 R0
WINDOW 3 16 52 Left 2
SYMATTR Value td=10n
SYMATTR InstName A52
SYMBOL Digital\\and 1936 2176 R0
WINDOW 3 16 52 Left 2
SYMATTR Value td=10n
SYMATTR InstName A53
SYMBOL Digital\\inv 16 2304 R0
SYMATTR InstName A54
SYMBOL Digital\\and 512 2576 R0
WINDOW 3 16 52 Left 2
SYMATTR Value td=10n
SYMATTR InstName A55
SYMBOL Digital\\and 528 2784 R0
WINDOW 3 16 52 Left 2
SYMATTR Value td=10n
SYMATTR InstName A56
SYMBOL Digital\\and 400 2912 R0
SYMATTR InstName A57
SYMBOL Digital\\and 720 2608 R0
WINDOW 3 16 52 Left 2
SYMATTR Value td=10n
SYMATTR InstName A58
SYMBOL Digital\\and 736 2736 R0
WINDOW 3 16 52 Left 2
SYMATTR Value td=10n
SYMATTR InstName A59
SYMBOL Digital\\and 1712 2528 R0
WINDOW 3 16 52 Left 2
SYMATTR Value td=10n
SYMATTR InstName A60
SYMBOL Digital\\and 1728 2736 R0
WINDOW 3 16 52 Left 2
SYMATTR Value td=10n
SYMATTR InstName A61
SYMBOL Digital\\and 1600 2864 R0
WINDOW 3 16 52 Left 2
SYMATTR Value td=10n
SYMATTR InstName A62
SYMBOL Digital\\and 1920 2560 R0
WINDOW 3 16 52 Left 2
SYMATTR Value td=10n
SYMATTR InstName A63
SYMBOL Digital\\and 1936 2688 R0
WINDOW 3 16 52 Left 2
SYMATTR Value td=10n
SYMATTR InstName A64
SYMBOL Digital\\inv 16 2816 R0
SYMATTR InstName A65
SYMBOL Digital\\and 496 3120 R0
WINDOW 3 16 52 Left 2
SYMATTR Value td=10n
SYMATTR InstName A66
SYMBOL Digital\\and 512 3328 R0
WINDOW 3 16 52 Left 2
SYMATTR Value td=10n
SYMATTR InstName A67
SYMBOL Digital\\and 384 3456 R0
SYMATTR InstName A68
SYMBOL Digital\\and 704 3152 R0
WINDOW 3 16 52 Left 2
SYMATTR Value td=10n
SYMATTR InstName A69
SYMBOL Digital\\and 720 3280 R0
WINDOW 3 16 52 Left 2
SYMATTR Value td=10n
SYMATTR InstName A70
SYMBOL Digital\\and 1696 3072 R0
WINDOW 3 16 52 Left 2
SYMATTR Value td=10n
SYMATTR InstName A71
SYMBOL Digital\\and 1712 3280 R0
WINDOW 3 16 52 Left 2
SYMATTR Value td=10n
SYMATTR InstName A72
SYMBOL Digital\\and 1584 3408 R0
WINDOW 3 16 52 Left 2
SYMATTR Value td=10n
SYMATTR InstName A73
SYMBOL Digital\\and 1904 3104 R0
WINDOW 3 16 52 Left 2
SYMATTR Value td=10n
SYMATTR InstName A74
SYMBOL Digital\\and 1920 3232 R0
WINDOW 3 16 52 Left 2
SYMATTR Value td=10n
SYMATTR InstName A75
SYMBOL Digital\\inv 0 3360 R0
SYMATTR InstName A76
SYMBOL Digital\\and 496 3632 R0
WINDOW 3 16 52 Left 2
SYMATTR Value td=10n
SYMATTR InstName A77
SYMBOL Digital\\and 512 3840 R0
WINDOW 3 16 52 Left 2
SYMATTR Value td=10n
SYMATTR InstName A78
SYMBOL Digital\\and 384 3968 R0
SYMATTR InstName A79
SYMBOL Digital\\and 704 3664 R0
WINDOW 3 16 52 Left 2
SYMATTR Value td=10n
SYMATTR InstName A80
SYMBOL Digital\\and 720 3792 R0
WINDOW 3 16 52 Left 2
SYMATTR Value td=10n
SYMATTR InstName A81
SYMBOL Digital\\and 1696 3584 R0
WINDOW 3 16 52 Left 2
SYMATTR Value td=10n
SYMATTR InstName A82
SYMBOL Digital\\and 1712 3792 R0
WINDOW 3 16 52 Left 2
SYMATTR Value td=10n
SYMATTR InstName A83
SYMBOL Digital\\and 1584 3920 R0
WINDOW 3 16 52 Left 2
SYMATTR Value td=10n
SYMATTR InstName A84
SYMBOL Digital\\and 1904 3616 R0
WINDOW 3 16 52 Left 2
SYMATTR Value td=10n
SYMATTR InstName A85
SYMBOL Digital\\and 1920 3744 R0
WINDOW 3 16 52 Left 2
SYMATTR Value td=10n
SYMATTR InstName A86
SYMBOL Digital\\inv 0 3872 R0
SYMATTR InstName A87
SYMBOL Digital\\inv -624 -160 R90
SYMATTR InstName A88
SYMBOL Digital\\and -528 -96 R0
SYMATTR InstName A89
SYMBOL Digital\\and -528 64 R0
SYMATTR InstName A90
SYMBOL Digital\\or -336 -16 R0
SYMATTR InstName A91
SYMBOL Digital\\inv -672 896 R90
SYMATTR InstName A92
SYMBOL Digital\\and -576 960 R0
SYMATTR InstName A93
SYMBOL Digital\\and -576 1120 R0
SYMATTR InstName A94
SYMBOL Digital\\or -384 1040 R0
SYMATTR InstName A95
SYMBOL Digital\\inv -688 1424 R90
SYMATTR InstName A96
SYMBOL Digital\\and -592 1488 R0
SYMATTR InstName A97
SYMBOL Digital\\and -592 1648 R0
SYMATTR InstName A98
SYMBOL Digital\\or -400 1568 R0
SYMATTR InstName A99
SYMBOL Digital\\inv -672 1952 R90
SYMATTR InstName A100
SYMBOL Digital\\and -576 2016 R0
SYMATTR InstName A101
SYMBOL Digital\\and -576 2176 R0
SYMATTR InstName A102
SYMBOL Digital\\or -384 2096 R0
SYMATTR InstName A103
SYMBOL Digital\\inv -656 2464 R90
SYMATTR InstName A104
SYMBOL Digital\\and -560 2528 R0
SYMATTR InstName A105
SYMBOL Digital\\and -560 2688 R0
SYMATTR InstName A106
SYMBOL Digital\\or -368 2608 R0
SYMATTR InstName A107
SYMBOL Digital\\inv -672 2992 R90
SYMATTR InstName A108
SYMBOL Digital\\and -576 3056 R0
SYMATTR InstName A109
SYMBOL Digital\\and -576 3216 R0
SYMATTR InstName A110
SYMBOL Digital\\or -384 3136 R0
SYMATTR InstName A111
SYMBOL Digital\\inv -656 3520 R90
SYMATTR InstName A112
SYMBOL Digital\\and -560 3584 R0
SYMATTR InstName A113
SYMBOL Digital\\and -560 3744 R0
SYMATTR InstName A114
SYMBOL Digital\\or -368 3664 R0
SYMATTR InstName A115
SYMBOL Digital\\inv -1440 336 R90
SYMATTR InstName A116
SYMBOL Digital\\and -1344 400 R0
SYMATTR InstName A117
SYMBOL Digital\\and -1344 560 R0
SYMATTR InstName A118
SYMBOL Digital\\or -1152 480 R0
SYMATTR InstName A119
SYMBOL voltage -912 144 R90
WINDOW 0 -32 56 VBottom 2
WINDOW 3 32 56 VTop 2
WINDOW 123 0 0 Left 0
WINDOW 39 0 0 Left 0
SYMATTR InstName Data-0
SYMATTR Value 1
SYMBOL voltage -1728 640 R90
WINDOW 0 -32 56 VBottom 2
WINDOW 3 32 56 VTop 2
WINDOW 123 0 0 Left 0
WINDOW 39 0 0 Left 0
SYMATTR InstName Data-1
SYMATTR Value 0
SYMBOL voltage -960 1200 R90
WINDOW 0 -32 56 VBottom 2
WINDOW 3 32 56 VTop 2
WINDOW 123 0 0 Left 0
WINDOW 39 0 0 Left 0
SYMATTR InstName Data-2
SYMATTR Value 1
SYMBOL voltage -976 1728 R90
WINDOW 0 -32 56 VBottom 2
WINDOW 3 32 56 VTop 2
WINDOW 123 0 0 Left 0
WINDOW 39 0 0 Left 0
SYMATTR InstName Data-3
SYMATTR Value 0
SYMBOL voltage -960 2256 R90
WINDOW 0 -32 56 VBottom 2
WINDOW 3 32 56 VTop 2
WINDOW 123 0 0 Left 0
WINDOW 39 0 0 Left 0
SYMATTR InstName Data-4
SYMATTR Value 1
SYMBOL voltage -944 2768 R90
WINDOW 0 -32 56 VBottom 2
WINDOW 3 32 56 VTop 2
WINDOW 123 0 0 Left 0
WINDOW 39 0 0 Left 0
SYMATTR InstName Data-5
SYMATTR Value 0
SYMBOL voltage -960 3296 R90
WINDOW 0 -32 56 VBottom 2
WINDOW 3 32 56 VTop 2
WINDOW 123 0 0 Left 0
WINDOW 39 0 0 Left 0
SYMATTR InstName Data-6
SYMATTR Value 1
SYMBOL voltage -944 3824 R90
WINDOW 0 -32 56 VBottom 2
WINDOW 3 32 56 VTop 2
WINDOW 123 0 0 Left 0
WINDOW 39 0 0 Left 0
SYMATTR InstName Data-7
SYMATTR Value 0
SYMBOL voltage -1616 -256 R90
WINDOW 0 -32 56 VBottom 2
WINDOW 3 32 56 VTop 2
WINDOW 123 0 0 Left 0
WINDOW 39 0 0 Left 0
SYMATTR InstName LOAD
SYMATTR Value PULSE(1 0 50u 1n 1n 50u 100u)
TEXT 472 -520 Left 2 !.tran 200u
TEXT -664 640 Left 2 ;.tran 200u

The netlist it stands for:
* 8-Bit-Register.asc
A1 0 N006 0 N007 0 N008 0 0 AND td=10n
A2 0 N007 N014 0 0 N013 0 0 AND td=10n
A3 0 N006 0 N006 0 N014 0 0 AND
A4 0 N008 0 MQ-0 0 MQ0 0 0 AND td=10n
A5 0 MQ0 0 N013 0 MQ-0 0 0 AND td=10n
A6. 0 MQ0 0 N004 0 N005 0 0 AND td=10n
A7 0 N004 N012 0 0 N011 0 0 AND td=10n
A8 0 MQ0 0 MQ0 0 N012 0 0 AND td=10n
A9 0 N005 0 SQ-0 0 Q-0 0 0 AND td=10n
A10 0 Q-0 0 N011 0 SQ-0 0 0 AND td=10n
A11 N004 0 0 0 0 N007 0 0 BUF
V§CLOCK2 N004 0 PULSE(0 1V 0 1n 1n 10u 20u)
A6 0 N018 0 N020 0 N021 0 0 AND td=10n
A12 0 N020 N026 0 0 N025 0 0 AND td=10n
A13 0 N018 0 N018 0 N026 0 0 AND
A14 0 N021 0 MQ-1 0 MQ1 0 0 AND td=10n
A15 0 MQ1 0 N025 0 MQ-1 0 0 AND td=10n
A16 0 MQ1 0 N004 0 N017 0 0 AND td=10n
A17 0 N004 N024 0 0 N023 0 0 AND td=10n
A18 0 MQ1 0 MQ1 0 N024 0 0 AND td=10n
A19 0 N017 0 SQ-1 0 Q-1 0 0 AND td=10n
A20 0 Q-1 0 N023 0 SQ-1 0 0 AND td=10n
A21 N004 0 0 0 0 N020 0 0 BUF
A22 0 N030 0 N031 0 N032 0 0 AND td=10n
A23 0 N031 N038 0 0 N037 0 0 AND td=10n
A24 0 N030 0 N030 0 N038 0 0 AND
A25 0 N032 0 MQ-2 0 MQ2 0 0 AND td=10n
A26 0 MQ2 0 N037 0 MQ-2 0 0 AND td=10n
A27 0 MQ2 0 N004 0 N029 0 0 AND td=10n
A28 0 N004 N036 0 0 N035 0 0 AND td=10n
A29 0 MQ2 0 MQ2 0 N036 0 0 AND td=10n
A30 0 N029 0 SQ-2 0 Q-2 0 0 AND td=10n
A31 0 Q-2 0 N035 0 SQ-2 0 0 AND td=10n
A32 N004 0 0 0 0 N031 0 0 BUF
A33 0 N042 0 N043 0 N044 0 0 AND td=10n
A34 0 N043 N050 0 0 N049 0 0 AND td=10n
A35 0 N042 0 N042 0 N050 0 0 AND
A36 0 N044 0 MQ-3 0 MQ3 0 0 AND td=10n
A37 0 MQ3 0 N049 0 MQ-3 0 0 AND td=10n
A38 0 MQ3 0 N004 0 N041 0 0 AND td=10n
A39 0 N004 N048 0 0 N047 0 0 AND td=10n
A40 0 MQ3 0 MQ3 0 N048 0 0 AND td=10n
A41 0 N041 0 SQ-3 0 Q-3 0 0 AND td=10n
A42 0 Q-3 0 N047 0 SQ-3 0 0 AND td=10n
A43 N004 0 0 0 0 N043 0 0 BUF
A44 0 N054 0 N055 0 N056 0 0 AND td=10n
A45 0 N055 N062 0 0 N061 0 0 AND td=10n
A46 0 N054 0 N054 0 N062 0 0 AND
A47 0 N056 0 MQ-4 0 MQ4 0 0 AND td=10n
A48 0 MQ4 0 N061 0 MQ-4 0 0 AND td=10n
A49 0 MQ4 0 N004 0 N053 0 0 AND td=10n
A50 0 N004 N060 0 0 N059 0 0 AND td=10n
A51 0 MQ4 0 MQ4 0 N060 0 0 AND td=10n
A52 0 N053 0 SQ-4 0 Q-4 0 0 AND td=10n
A53 0 Q-4 0 N059 0 SQ-4 0 0 AND td=10n
A54 N004 0 0 0 0 N055 0 0 BUF
A55 0 N066 0 N067 0 N068 0 0 AND td=10n
A56 0 N067 N074 0 0 N073 0 0 AND td=10n
A57 0 N066 0 N066 0 N074 0 0 AND
A58 0 N068 0 MQ-5 0 MQ5 0 0 AND td=10n
A59 0 MQ5 0 N073 0 MQ-5 0 0 AND td=10n
A60 0 MQ5 0 N004 0 N065 0 0 AND td=10n
A61 0 N004 N072 0 0 N071 0 0 AND td=10n
A62 0 MQ5 0 MQ5 0 N072 0 0 AND td=10n
A63 0 N065 0 SQ-5 0 Q-5 0 0 AND td=10n
A64 0 Q-5 0 N071 0 SQ-5 0 0 AND td=10n
A65 N004 0 0 0 0 N067 0 0 BUF
A66 0 N078 0 N079 0 N080 0 0 AND td=10n
A67 0 N079 N086 0 0 N085 0 0 AND td=10n
A68 0 N078 0 N078 0 N086 0 0 AND
A69 0 N080 0 MQ-6 0 MQ6 0 0 AND td=10n
A70 0 MQ6 0 N085 0 MQ-6 0 0 AND td=10n
A71 0 MQ6 0 N004 0 N077 0 0 AND td=10n
A72 0 N004 N084 0 0 N083 0 0 AND td=10n
A73 0 MQ6 0 MQ6 0 N084 0 0 AND td=10n
A74 0 N077 0 SQ-6 0 Q-6 0 0 AND td=10n
A75 0 Q-6 0 N083 0 SQ-6 0 0 AND td=10n
A76 N004 0 0 0 0 N079 0 0 BUF
A77 0 N090 0 N091 0 N092 0 0 AND td=10n
A78 0 N091 N098 0 0 N097 0 0 AND td=10n
A79 0 N090 0 N090 0 N098 0 0 AND
A80 0 N092 0 MQ-7 0 MQ7 0 0 AND td=10n
A81 0 MQ7 0 N097 0 MQ-7 0 0 AND td=10n
A82 0 MQ7 0 N004 0 N089 0 0 AND td=10n
A83 0 N004 N096 0 0 N095 0 0 AND td=10n
A84 0 MQ7 0 MQ7 0 N096 0 0 AND td=10n
A85 0 N089 0 SQ-7 0 Q-7 0 0 AND td=10n
A86 0 Q-7 0 N095 0 SQ-7 0 0 AND td=10n
A87 N004 0 0 0 0 N091 0 0 BUF
A88 N001 0 0 0 0 N002 0 0 BUF
A89 0 N002 0 Q-0 0 0 N003 0 AND
A90 0 N001 0 N010 0 0 N009 0 AND
A91 0 N003 0 N009 0 0 N006 0 OR
A92 N001 0 0 0 0 N027 0 0 BUF
A93 0 N027 0 Q-2 0 0 N028 0 AND
A94 0 N001 0 N034 0 0 N033 0 AND
A95 0 N028 0 N033 0 0 N030 0 OR
A96 N001 0 0 0 0 N039 0 0 BUF
A97 0 N039 0 Q-3 0 0 N040 0 AND
A98 0 N001 0 N046 0 0 N045 0 AND
A99 0 N040 0 N045 0 0 N042 0 OR
A100 N001 0 0 0 0 N051 0 0 BUF
A101 0 N051 0 Q-4 0 0 N052 0 AND
A102 0 N001 0 N058 0 0 N057 0 AND
A103 0 N052 0 N057 0 0 N054 0 OR
A104 N001 0 0 0 0 N063 0 0 BUF
A105 0 N063 0 Q-5 0 0 N064 0 AND
A106 0 N001 0 N070 0 0 N069 0 AND
A107 0 N064 0 N069 0 0 N066 0 OR
A108 N001 0 0 0 0 N075 0 0 BUF
A109 0 N075 0 Q-6 0 0 N076 0 AND
A110 0 N001 0 N082 0 0 N081 0 AND
A111 0 N076 0 N081 0 0 N078 0 OR
A112 N001 0 0 0 0 N087 0 0 BUF
A113 0 N087 0 Q-7 0 0 N088 0 AND
A114 0 N001 0 N094 0 0 N093 0 AND
A115 0 N088 0 N093 0 0 N090 0 OR
A116 N001 0 0 0 0 N015 0 0 BUF
A117 0 N015 0 Q-1 0 0 N016 0 AND
A118 0 N001 0 N022 0 0 N019 0 AND
A119 0 N016 0 N019 0 0 N018 0 OR
V§Data-0 N010 0 1
V§Data-1 N022 0 0
V§Data-2 N034 0 1
V§Data-3 N046 0 0
V§Data-4 N058 0 1
V§Data-5 N070 0 0
V§Data-6 N082 0 1
V§Data-7 N094 0 0
V§LOAD N001 0 PULSE(1 0 50u 1n 1n 50u 100u)
.tran 200u
* .tran 200u
.backanno
.end